# EAGLE design PCB (EAGLE 9.6.2)
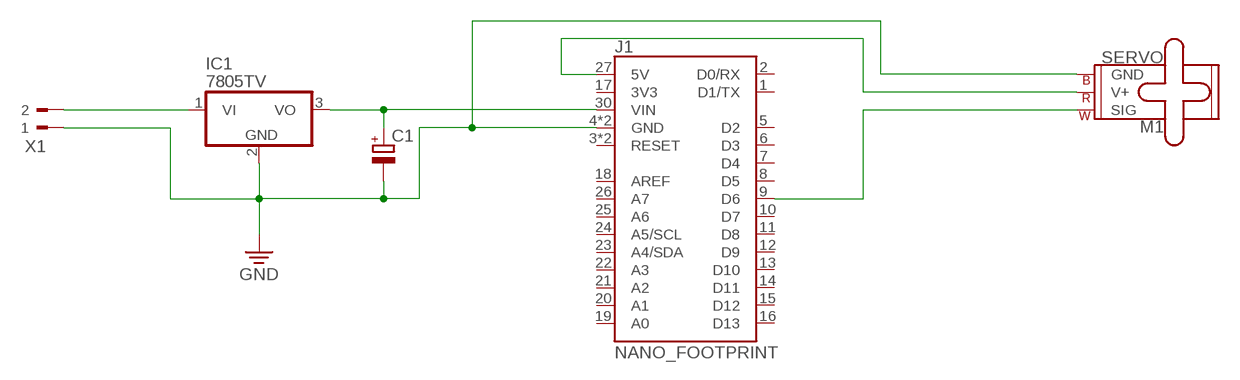
[diagram p0: schematic, sheet 1]

## Parts
C1  C-POL_RADIAL-32MM-DIA  [CAPPRD1000W100D2275H3200B]
IC1  7805TV  [TO220V]
J1  NANO_FOOTPRINT  [NANO]
M1  SERVO  [1X03]
X1  90-2  [90-2]

## Nets
GND: C1.2(-) IC1.2(GND) J1.4(GND) J1.29(GND) M1.3(GND) X1.1
N$1: IC1.1(VI) X1.2
N$2: C1.1(+) IC1.3(VO) J1.30(VIN)
N$3: J1.9(D6) M1.1(SIG)
N$5: J1.27(5V) M1.2(V+)
Unconnected: J1.1(D1/TX) J1.2(D0/RX) J1.3(RESET) J1.5(D2) J1.6(D3) J1.7(D4) J1.8(D5) J1.10(D7) J1.11(D8) J1.12(D9) J1.13(D10) J1.14(D11) J1.15(D12) J1.16(D13) J1.17(3V3) J1.18(AREF) J1.19(A0) J1.20(A1) J1.21(A2) J1.22(A3) J1.23(A4/SDA) J1.24(A5/SCL) J1.25(A6) J1.26(A7) J1.28(RESET)

## Library data of the parts
C1 = Capacitor:C-POL: Capacitor Polarised - Generic; CATEGORY: Capacitor
IC1 = linear:78*: Positive VOLTAGE REGULATOR Source: http://cache.national.com/ds/LM/LM78L05.pdf http://www.fairchildsemi.com/ds/LM/LM7805.pdf
J1 = SparkFun-Boards:NANO_FOOTPRINT: Generic Nano Footprint
M1 = SparkFun-Electromechanical:SERVO: Servo Motor 3-pin connector for a standard servo motor (voltage supply, ground, and control signal.) SparkFun Products Servo - Generic (Sub-Micro Size) <https://www.sparkfun.com/products/9065> (ROB-09065) Servo - Generic High Torque Continuous Rotation (Standard Size) <https://www.sparkfun.com/products/9347> (ROB-09347) Servo - Generic High Torque (Standard Size) <https://www.sparkfun.com/products/11965> (ROB-11965)
X1 = con-weidmueller-sl35:90-2: WEIDMUELLER CLAMP CONNECTOR; OC_FARNELL: unknown; OC_NEWARK: unknown

## Board
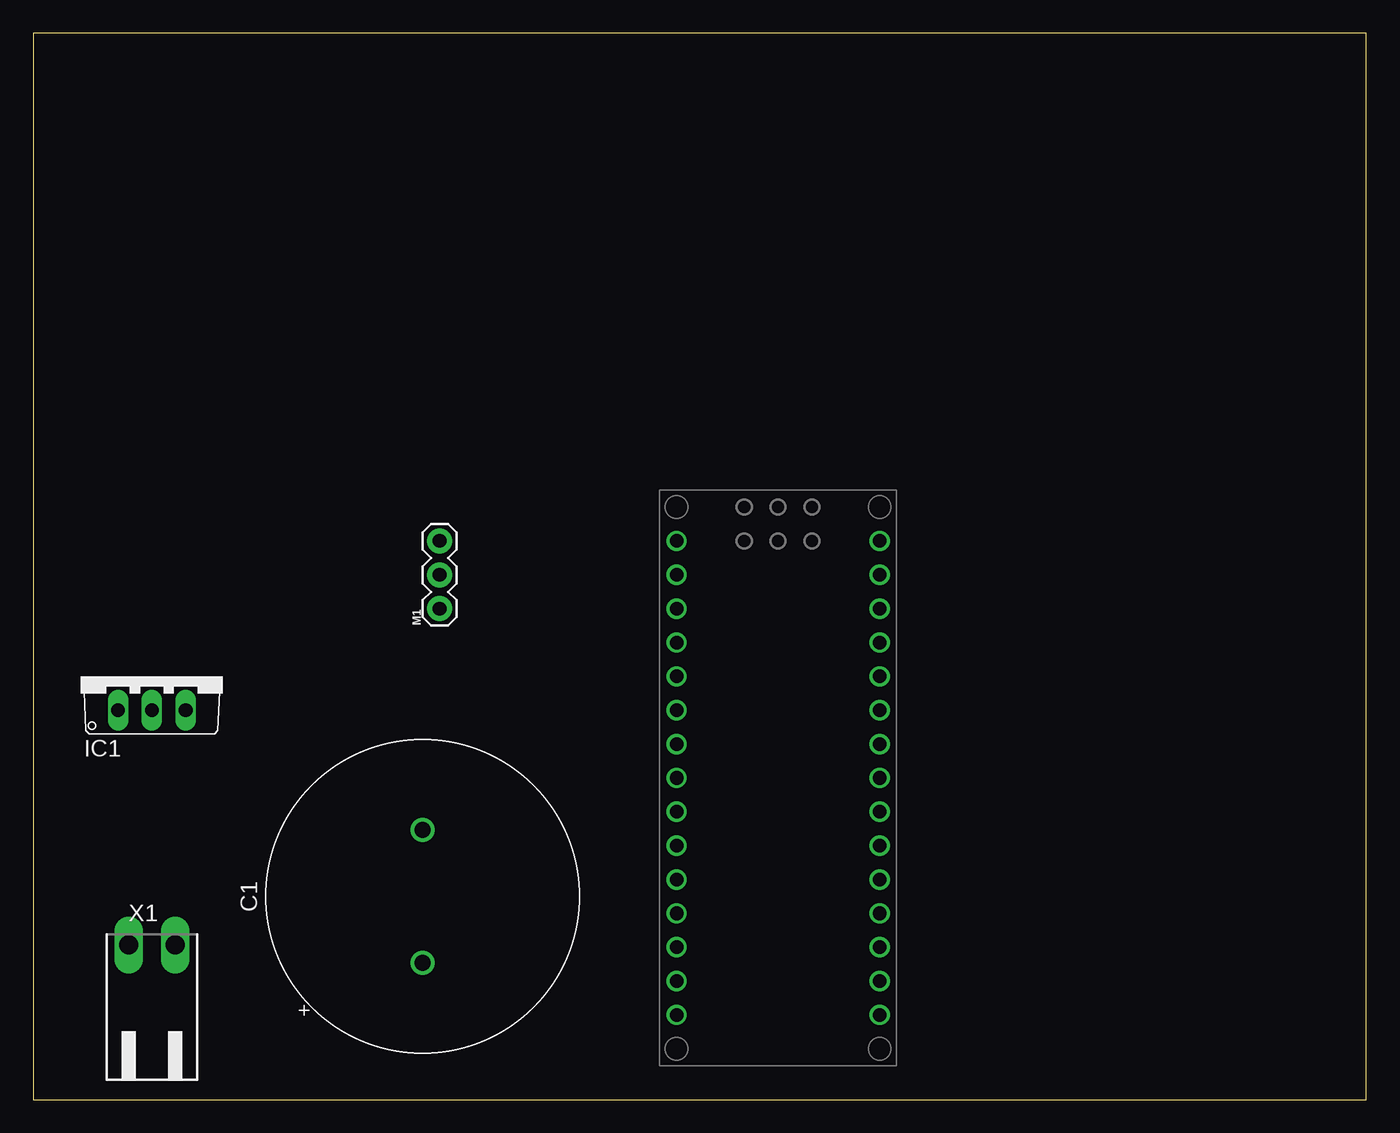
[diagram p1: board, top side]
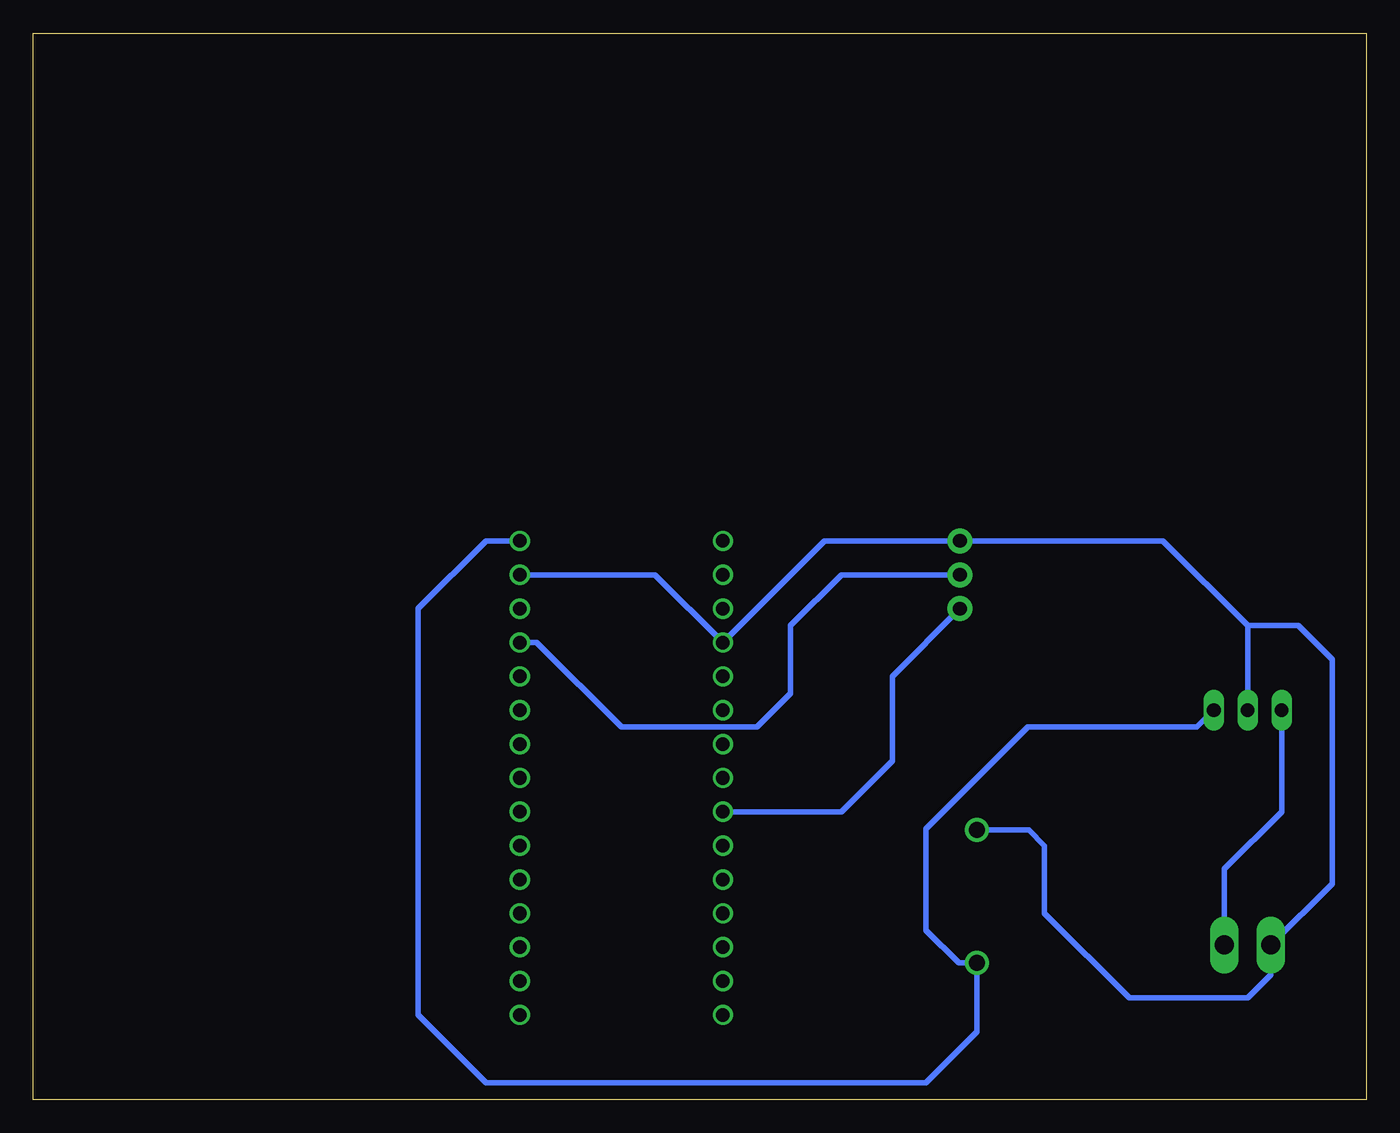
[diagram p2: board, bottom side, seen from below]

Size 100 x 80 mm. Coordinates in mm from the lower left corner, seen from the top.
Outline: 0,0 100,0 100,80 0,80 0,0
Copper layers (1*16): Top 0.035mm / dielectric 1.5mm / Bottom 0.035mm
Design rules "default": minimum track width 6mil, minimum drill 0.35mm, track to track 6mil, track to pad 6mil, pad to pad 6mil, via to via 6mil, smd to smd 6mil, copper to edge 40mil, drill to drill 6mil, minimum pad ring 10mil, minimum via ring 8mil, stop-mask expansion 4mil, vias tented up to drill 0mil, thermal gap 10mil

### Footprints (pad centres in the part's own frame; a part is rotated, then mirrored left to right if it is on the bottom)
CAPPRD1000W100D2275H3200B = drill 1.2 pad 1.8: 1 -5,0; 2 5,0
TO220V = drill 1.016 long: 1 -2.54,-2.54; 2 0,-2.54; 3 2.54,-2.54
NANO = drill 1.016: 1 -7.62,17.78; 2 -7.62,15.24; 3 -7.62,12.7; 4 -7.62,10.16; 5 -7.62,7.62; 6 -7.62,5.08; 7 -7.62,2.54; 8 -7.62,0; 9 -7.62,-2.54; 10 -7.62,-5.08; 11 -7.62,-7.62; 12 -7.62,-10.16; 13 -7.62,-12.7; 14 -7.62,-15.24; 15 -7.62,-17.78; 16 7.62,-17.78; 17 7.62,-15.24; 18 7.62,-12.7; 19 7.62,-10.16; 20 7.62,-7.62; 21 7.62,-5.08; 22 7.62,-2.54; 23 7.62,0; 24 7.62,2.54; 25 7.62,5.08; 26 7.62,7.62; 27 7.62,10.16; 28 7.62,12.7; 29 7.62,15.24; 30 7.62,17.78
1X03 = drill 1.016 pad 1.88: 1 0,0; 2 2.54,0; 3 5.08,0
90-2 = drill 1.422 long: 1 -1.75,5.25; 2 1.75,5.25

### Placement (x,y rotation side)
C1  29.21,15.24 90 top
IC1  8.89,31.75 0 top
J1  55.88,24.13 0 top
M1  30.48,36.83 90 top
X1  8.89,6.35 0 top

### Tracks (layer width: path | path; a pad name or v marks a point on that pad's centre or on a via)
GND
  Bottom 0.406: IC1.2 8.89,35.56 | C1.2 25.32,20.24 24.13,19.05 24.13,13.97 17.78,7.62 8.89,7.62 7.14,9.37 X1.1 2.54,16.2 2.54,33.02 5.08,35.56 8.89,35.56 | 8.89,35.56 15.24,41.91 M1.3 40.64,41.91 J1.4 53.34,39.37 J1.29
N$1
  Bottom 0.406: X1.2 10.64,17.3 6.35,21.59 IC1.1
N$2
  Bottom 0.406: IC1.3 12.7,27.94 25.4,27.94 33.02,20.32 33.02,12.7 30.56,10.24 C1.1 29.21,5.08 33.02,1.27 66.04,1.27 71.12,6.35 71.12,36.83 66.04,41.91 J1.30
N$3
  Bottom 0.406: M1.1 35.56,31.75 35.56,25.4 39.37,21.59 J1.9
N$5
  Bottom 0.406: M1.2 39.37,39.37 43.18,35.56 43.18,30.48 45.72,27.94 55.88,27.94 62.23,34.29 J1.27